# Altium project PCB_Project.PrjPcb
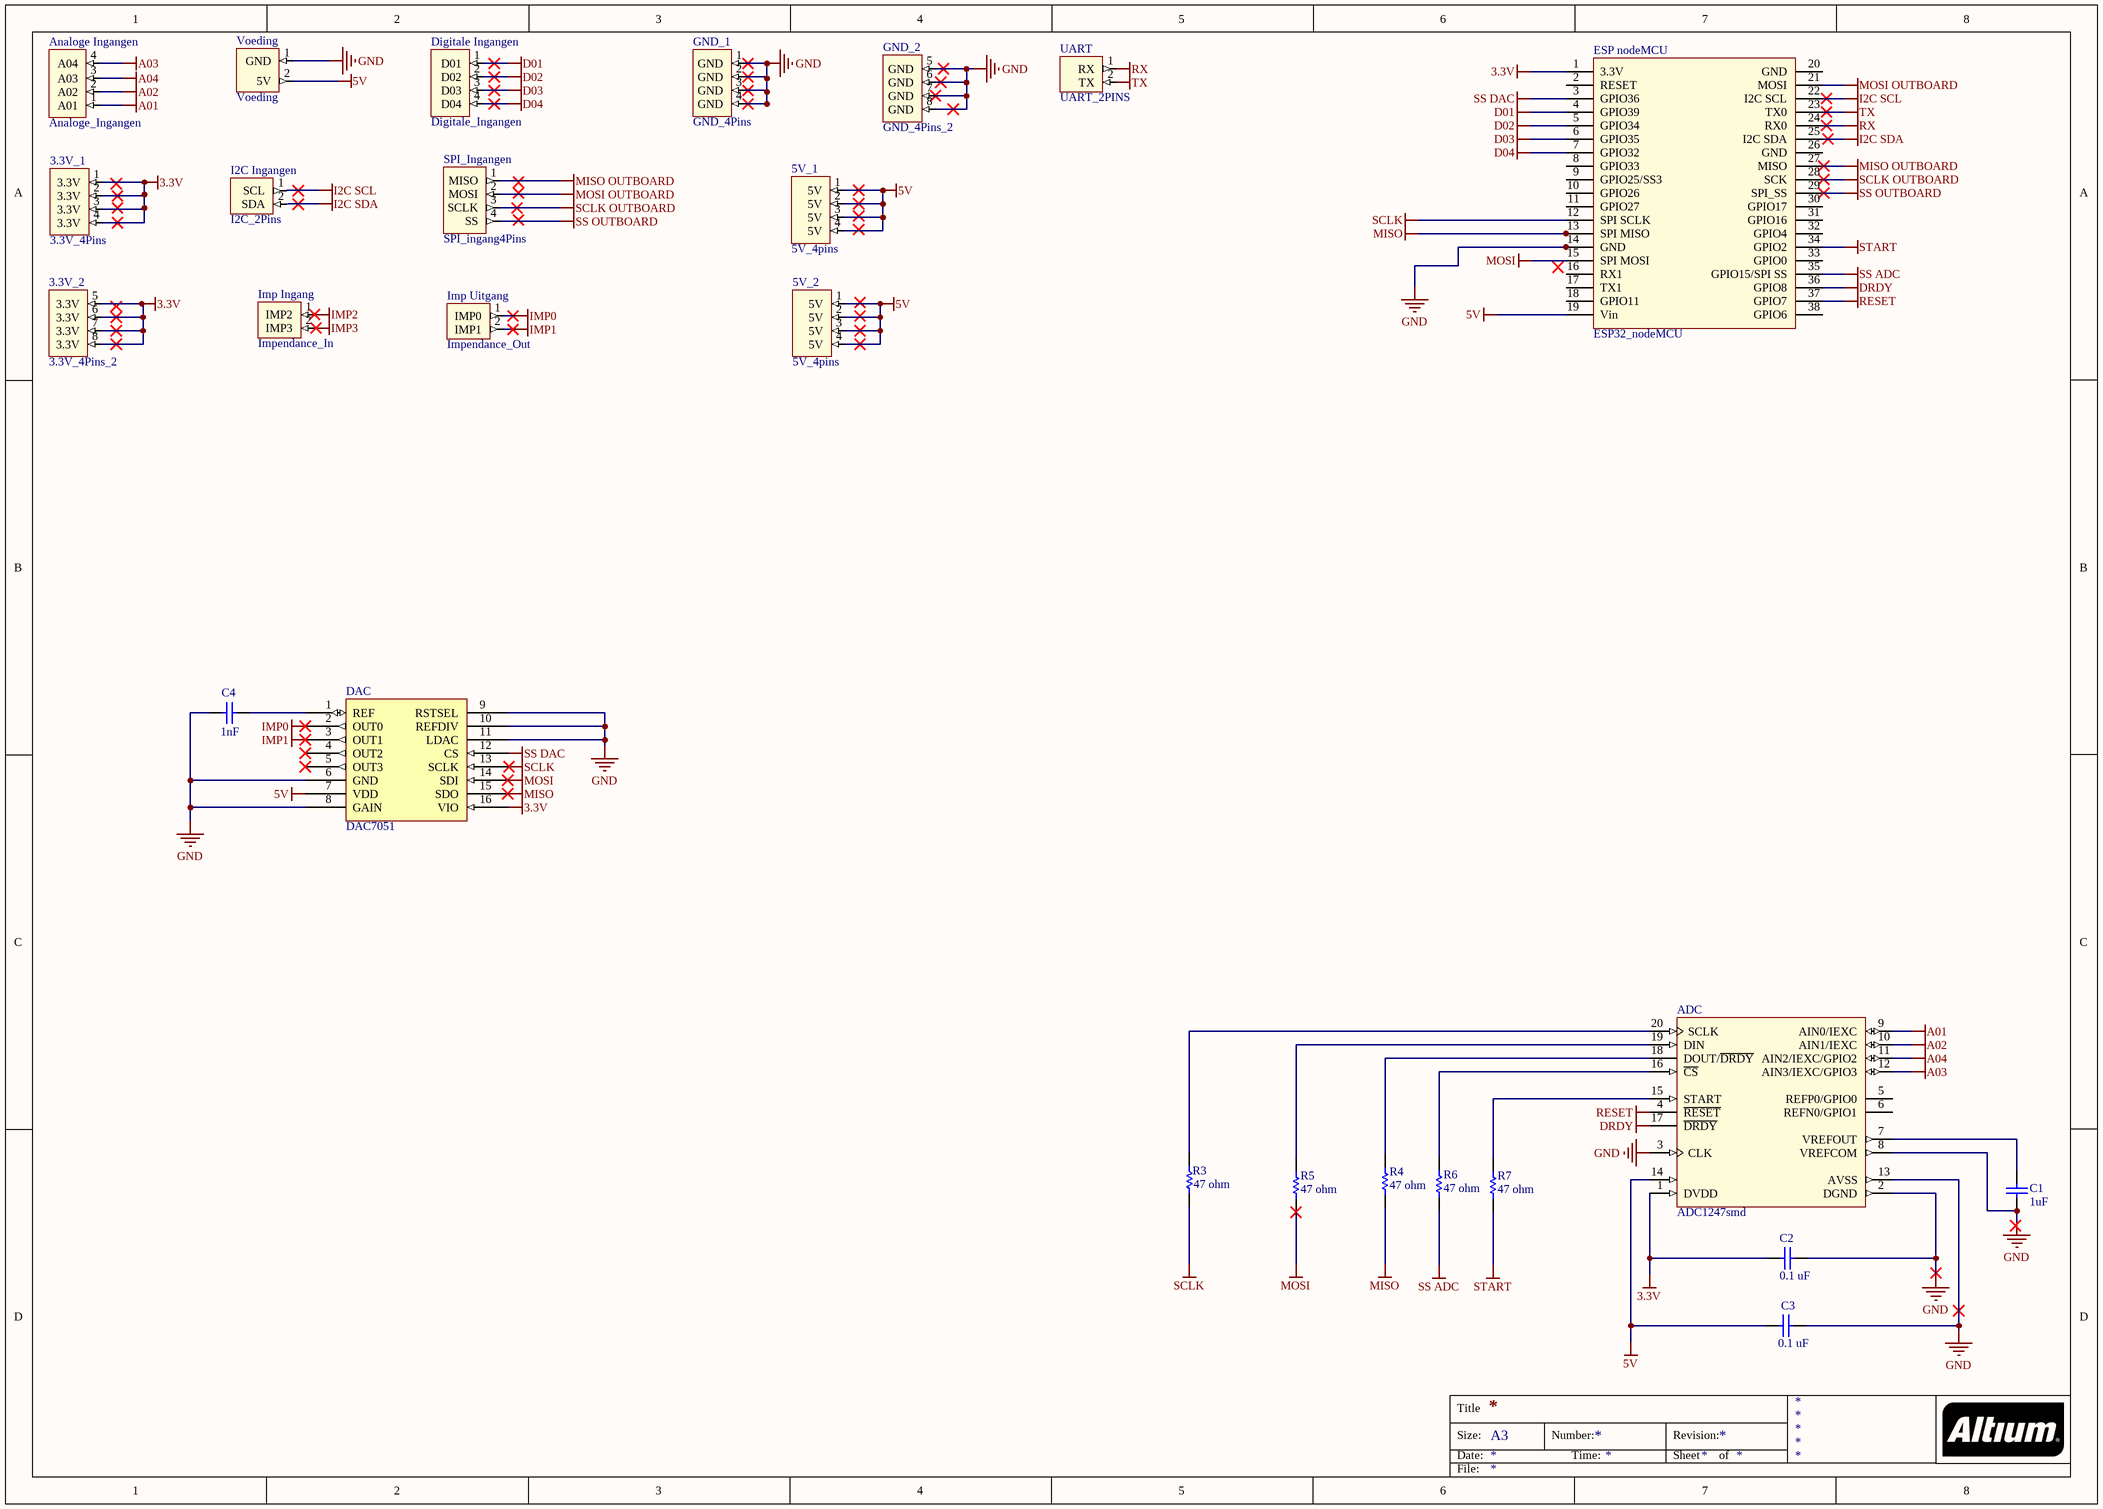
[diagram p0: TestPCB1.SchDoc]
1 sheet, 29 parts. Net scope: global (net labels, ports and power ports of the same name join across sheets).
Board files: PCBOntwerp.PcbDoc, PCB_v2.PcbDoc

## Sheet TestPCB1.SchDoc
size A3

### Parts
3.3V_1  3.3V_4Pins  [TBL007A-500-04GY]
3.3V_2  3.3V_4Pins_2  [TBL007A-500-04GY]
5V_1  5V_4pins  [TBL007A-500-04GY]
5V_2  5V_4pins  [TBL007A-500-04GY]
*1  Component_1
*2  Component_1
*3  Component_1
ADC  ADC1247smd  [TI-PW20_M]
Analoge_Ingangen  Analoge_Ingangen  [TBL007A-500-04GY]
C1  1uF  [CAPC2013X94X50ML20T25]
C2  0.1 uF  [CAPC2013X94X50ML20T25]
C3  0.1 uF  [CAPC2013X94X50ML20T25]
C4  1nF  [CAPC2013X94X50ML20T25]
DAC  DAC7051  [QFN50P300X300X80-17N]
Digitale_Ingangen  Digitale_Ingangen  [TBL007A-500-04GY]
ESP_nodeMCU  ESP32_nodeMCU  [esp32_nodemcu_v2]
GND_1  GND_4Pins  [TBL007A-500-04GY]
GND_2  GND_4Pins_2  [TBL007A-500-04GY]
I2C_Ingangen  I2C_2Pins  [TBL007A-500-02GY]
Imp_Ingang  Impendance_In  [TBL007A-500-02GY]
Imp_Uitgang  Impendance_Out  [TBL007A-500-02GY]
R3  47 ohm  [754-RG2012N-470-W-T1]
R4  47 ohm  [754-RG2012N-470-W-T1]
R5  47 ohm  [754-RG2012N-470-W-T1]
R6  47 ohm  [754-RG2012N-470-W-T1]
R7  47 ohm  [754-RG2012N-470-W-T1]
SPI_Ingangen  SPI_ingang4Pins  [TBL007A-500-04GY]
UART  UART_2PINS  [TBL007A-500-02GY]
Voeding  Voeding  [TBL007A-500-02GY]

### Nets
3.3V: 3.3V_1.1(3.3V) 3.3V_1.2(3.3V) 3.3V_1.3(3.3V) 3.3V_1.4(3.3V) 3.3V_2.5(3.3V) 3.3V_2.6(3.3V) 3.3V_2.7(3.3V) 3.3V_2.8(3.3V) ADC.1(DVDD) C2.1 DAC.16(VIO) ESP_nodeMCU.1(3.3V)
5V: 5V_1.1(5V) 5V_1.2(5V) 5V_1.3(5V) 5V_1.4(5V) 5V_2.1(5V) 5V_2.2(5V) 5V_2.3(5V) 5V_2.4(5V) ADC.14(AVDD) C3.1 DAC.7(VDD) ESP_nodeMCU.19(Vin) Voeding.2(5V)
A01: ADC.9(AIN0/IEXC) Analoge_Ingangen.1(A01)
A02: ADC.10(AIN1/IEXC) Analoge_Ingangen.2(A02)
A03: ADC.12(AIN3/IEXC/GPIO3) Analoge_Ingangen.4(A04)
A04: ADC.11(AIN2/IEXC/GPIO2) Analoge_Ingangen.3(A03)
D01: Digitale_Ingangen.1(D01) ESP_nodeMCU.4(GPIO39)
D02: Digitale_Ingangen.2(D02) ESP_nodeMCU.5(GPIO34)
D03: Digitale_Ingangen.3(D03) ESP_nodeMCU.6(GPIO35)
D04: Digitale_Ingangen.4(D04) ESP_nodeMCU.7(GPIO32)
DRDY: ADC.17(~{DRDY}) ESP_nodeMCU.36(GPIO8)
GND: ADC.2(DGND) ADC.3(CLK) ADC.8(VREFCOM) ADC.13(AVSS) C1.1 C2.2 C3.2 C4.2 DAC.6(GND) DAC.8(GAIN) DAC.9(RSTSEL) DAC.10(REFDIV) DAC.11(LDAC) ESP_nodeMCU.14(GND) GND_1.1(GND) GND_1.2(GND) GND_1.3(GND) GND_1.4(GND) GND_2.5(GND) GND_2.6(GND) GND_2.7(GND) GND_2.8(GND) Voeding.1(GND)
I2C SCL: ESP_nodeMCU.22(I2C_SCL) I2C_Ingangen.1(SCL)
I2C SDA: ESP_nodeMCU.25(I2C_SDA) I2C_Ingangen.2(SDA)
IMP0: DAC.2(OUT0) Imp_Uitgang.1(IMP0)
IMP1: DAC.3(OUT1) Imp_Uitgang.2(IMP1)
IMP2: Imp_Ingang.1(IMP2)
IMP3: Imp_Ingang.2(IMP3)
MISO: DAC.15(SDO) ESP_nodeMCU.13(SPI_MISO) R4.1
MISO OUTBOARD: ESP_nodeMCU.27(MISO) SPI_Ingangen.1(MISO)
MOSI: DAC.14(SDI) ESP_nodeMCU.15(SPI_MOSI) R5.1
MOSI OUTBOARD: ESP_nodeMCU.21(MOSI) SPI_Ingangen.2(MOSI)
RESET: ADC.4(~{RESET}) ESP_nodeMCU.37(GPIO7)
RX: ESP_nodeMCU.24(RX0) UART.1(RX)
SCLK: DAC.13(SCLK) ESP_nodeMCU.12(SPI_SCLK) R3.2
SCLK OUTBOARD: ESP_nodeMCU.28(SCK) SPI_Ingangen.3(SCLK)
SS ADC: ESP_nodeMCU.35(GPIO15/SPI_SS) R6.1
SS DAC: DAC.12(CS) ESP_nodeMCU.3(GPIO36)
SS OUTBOARD: ESP_nodeMCU.29(SPI_SS) SPI_Ingangen.4(SS)
START: ESP_nodeMCU.34(GPIO2) R7.1
TX: ESP_nodeMCU.23(TX0) UART.2(TX)
NetADC_7: ADC.7(VREFOUT) C1.2
NetADC_15: ADC.15(START) R7.2
NetADC_16: ADC.16(~{CS}) R6.2
NetADC_18: ADC.18(DOUT/~{DRDY}) R4.2
NetADC_19: ADC.19(DIN) R5.2
NetADC_20: ADC.20(SCLK) R3.1
NetC4_1: C4.1 DAC.1(REF)

Not connected (* = marked no-connect by the designer): *1 1(REF) 2(OUT0) 3(OUT1) 4(OUT2) 5(OUT3) 6(GND) 7(VDD) 8(GAIN) 9(RSTSEL) 10(REFDIF) 11(LDAC) 12(CS) 13(SCLK) 14(SDI) 15(SDO/ALARM) 16(VIO); *2 1(REF) 2(OUT0) 3(OUT1) 4(OUT2) 5(OUT3) 6(GND) 7(VDD) 8(GAIN) 9(RSTSEL) 10(REFDIF) 11(LDAC) 12(CS) 13(SCLK) 14(SDI) 15(SDO/ALARM) 16(VIO); *3 1(REF) 2(OUT0) 3(OUT1) 4(OUT2) 5(OUT3) 6(GND) 7(VDD) 8(GAIN) 9(RSTSEL) 10(REFDIF) 11(LDAC) 12(CS) 13(SCLK) 14(SDI) 15(SDO/ALARM) 16(VIO); ADC 5(REFP0/GPIO0) 6(REFN0/GPIO1); DAC 4(OUT2)* 5(OUT3)*; ESP_nodeMCU 2(RESET) 8(GPIO33) 9(GPIO25/SS3) 10(GPIO26) 11(GPIO27) 16(RX1) 17(TX1) 18(GPIO11) 20(GND) 26(GND) 30(GPIO17) 31(GPIO16) 32(GPIO4) 33(GPIO0) 38(GPIO6)

### Notes on the sheet
- Title
- Size:
- Date:
- A3
- Number:
- Time:
- Revision:
- Sheet
- of
- File:

### Library data of the parts
C1-C4 = CMP-2007-04171-1: Manufacturer: AVX Interconnect / Elco; Part Number: 08051C104JAT2A
R3-R7 = CMP-2001-04866-1: Part Number: RG2012N-470-W-T1; Manufacturer: Susumu